# Altium schematic sheet XH2.54-2P_直插_2024-04-30.schdoc
size 39 x 30 mm
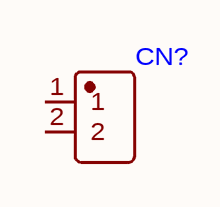
[diagram p0: XH2.54-2P_直插_2024-04-30.schdoc]

## Parts
CN?  (no value)  [CONN-TH_2P-P2.50-XH2.54-2P]

## Nets

Not connected (* = marked no-connect by the designer): CN? 1 2

## Library data of the parts
CN? = XH2.54*2P_直插